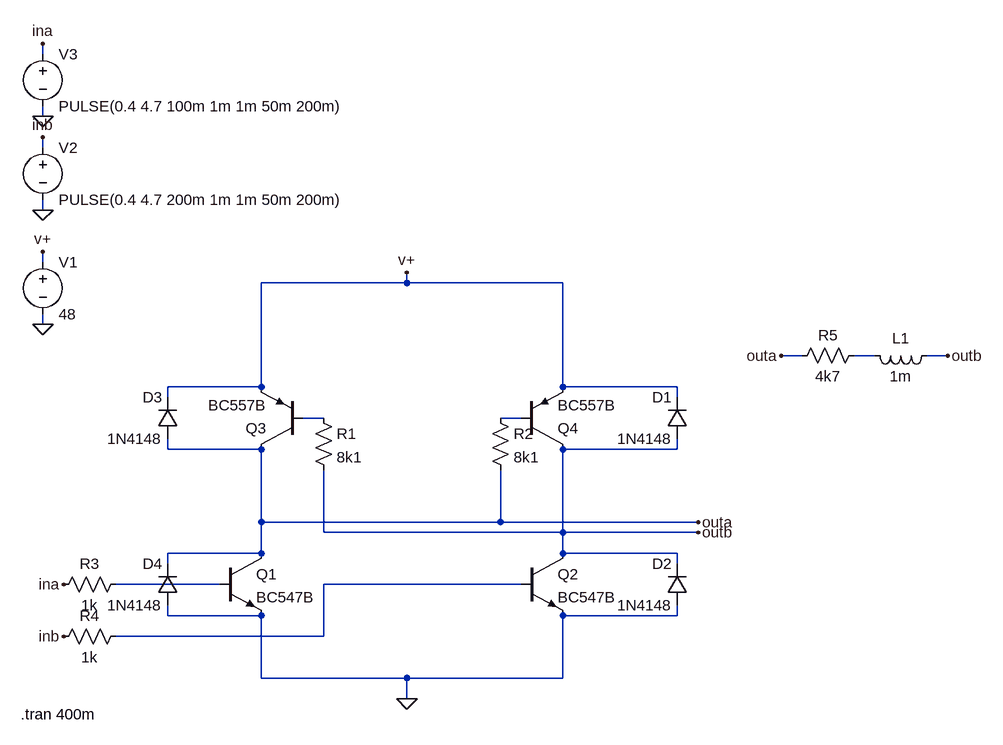
[diagram p0: schematic hbridge_ltspice_simulation.asc]
hbridge_ltspice_simulation.asc, the LTspice schematic file:
Version 4
SHEET 1 1660 680
WIRE 192 -624 192 -640
WIRE 192 -528 192 -544
WIRE 192 -480 192 -496
WIRE 192 -384 192 -400
WIRE 192 -304 192 -320
WIRE 752 -272 752 -288
WIRE 752 -272 528 -272
WIRE 992 -272 752 -272
WIRE 192 -208 192 -224
WIRE 1360 -160 1328 -160
WIRE 1472 -160 1440 -160
WIRE 1584 -160 1552 -160
WIRE 528 -112 528 -272
WIRE 528 -112 384 -112
WIRE 992 -112 992 -272
WIRE 1168 -112 992 -112
WIRE 384 -96 384 -112
WIRE 1168 -96 1168 -112
WIRE 624 -64 592 -64
WIRE 928 -64 896 -64
WIRE 384 -16 384 -32
WIRE 528 -16 384 -16
WIRE 1168 -16 1168 -32
WIRE 1168 -16 992 -16
WIRE 528 96 528 -16
WIRE 896 96 896 16
WIRE 896 96 528 96
WIRE 1200 96 896 96
WIRE 624 112 624 16
WIRE 992 112 992 -16
WIRE 992 112 624 112
WIRE 1200 112 992 112
WIRE 528 144 528 96
WIRE 528 144 384 144
WIRE 992 144 992 112
WIRE 1168 144 992 144
WIRE 384 160 384 144
WIRE 1168 160 1168 144
WIRE 464 192 304 192
WIRE 928 192 624 192
WIRE 384 240 384 224
WIRE 528 240 384 240
WIRE 1168 240 1168 224
WIRE 1168 240 992 240
WIRE 624 272 624 192
WIRE 624 272 304 272
WIRE 528 336 528 240
WIRE 752 336 528 336
WIRE 992 336 992 240
WIRE 992 336 752 336
WIRE 752 368 752 336
FLAG 192 -208 0
FLAG 192 -320 v+
FLAG 752 -288 v+
FLAG 752 368 0
FLAG 1200 96 outa
FLAG 1200 112 outb
FLAG 192 -384 0
FLAG 192 -528 0
FLAG 192 -496 inb
FLAG 192 -640 ina
FLAG 224 192 ina
FLAG 224 272 inb
FLAG 1328 -160 outa
FLAG 1584 -160 outb
SYMBOL npn 464 144 R0
SYMATTR InstName Q1
SYMATTR Value BC547B
SYMBOL npn 928 144 R0
SYMATTR InstName Q2
SYMATTR Value BC547B
SYMBOL pnp 592 -16 R180
SYMATTR InstName Q3
SYMATTR Value BC557B
SYMBOL pnp 928 -16 M180
SYMATTR InstName Q4
SYMATTR Value BC557B
SYMBOL res 608 -80 R0
SYMATTR InstName R1
SYMATTR Value 8k1
SYMBOL res 880 -80 R0
SYMATTR InstName R2
SYMATTR Value 8k1
SYMBOL voltage 192 -320 R0
WINDOW 123 0 0 Left 2
WINDOW 39 0 0 Left 2
SYMATTR InstName V1
SYMATTR Value 48
SYMBOL res 320 176 R90
WINDOW 0 0 56 VBottom 2
WINDOW 3 32 56 VTop 2
SYMATTR InstName R3
SYMATTR Value 1k
SYMBOL res 320 256 R90
WINDOW 0 0 56 VBottom 2
WINDOW 3 32 56 VTop 2
SYMATTR InstName R4
SYMATTR Value 1k
SYMBOL voltage 192 -496 R0
WINDOW 123 0 0 Left 2
WINDOW 39 0 0 Left 2
SYMATTR InstName V2
SYMATTR Value PULSE(0.4 4.7 200m 1m 1m 50m 200m)
SYMBOL voltage 192 -640 R0
WINDOW 123 0 0 Left 2
WINDOW 39 0 0 Left 2
SYMATTR InstName V3
SYMATTR Value PULSE(0.4 4.7 100m 1m 1m 50m 200m)
SYMBOL res 1456 -176 R90
WINDOW 0 0 56 VBottom 2
WINDOW 3 32 56 VTop 2
SYMATTR InstName R5
SYMATTR Value 4k7
SYMBOL ind 1568 -176 R90
WINDOW 0 5 56 VBottom 2
WINDOW 3 32 56 VTop 2
SYMATTR InstName L1
SYMATTR Value 1m
SYMBOL diode 1184 -32 R180
WINDOW 0 24 64 Left 2
WINDOW 3 24 0 Left 2
SYMATTR InstName D1
SYMATTR Value 1N4148
SYMBOL diode 1184 224 R180
WINDOW 0 24 64 Left 2
WINDOW 3 24 0 Left 2
SYMATTR InstName D2
SYMATTR Value 1N4148
SYMBOL diode 400 -32 R180
WINDOW 0 24 64 Left 2
WINDOW 3 24 0 Left 2
SYMATTR InstName D3
SYMATTR Value 1N4148
SYMBOL diode 400 224 R180
WINDOW 0 24 64 Left 2
WINDOW 3 24 0 Left 2
SYMATTR InstName D4
SYMATTR Value 1N4148
TEXT 158 392 Left 2 !.tran 400m

The netlist it stands for:
* hbridge_ltspice_simulation.asc
Q1 outa N004 0 0 BC547B
Q2 outb N005 0 0 BC547B
Q3 outa N002 v+ 0 BC557B
Q4 outb N003 v+ 0 BC557B
R1 N002 outb 8k1
R2 N003 outa 8k1
V1 v+ 0 48
R3 N004 ina 1k
R4 N005 inb 1k
V2 inb 0 PULSE(0.4 4.7 200m 1m 1m 50m 200m)
V3 ina 0 PULSE(0.4 4.7 100m 1m 1m 50m 200m)
R5 N001 outa 4k7
L1 outb N001 1m
D1 outb v+ 1N4148
D2 0 outb 1N4148
D3 outa v+ 1N4148
D4 0 outa 1N4148
.model D D
.lib standard.dio
.model NPN NPN
.model PNP PNP
.lib standard.bjt
.tran 400m
.backanno
.end